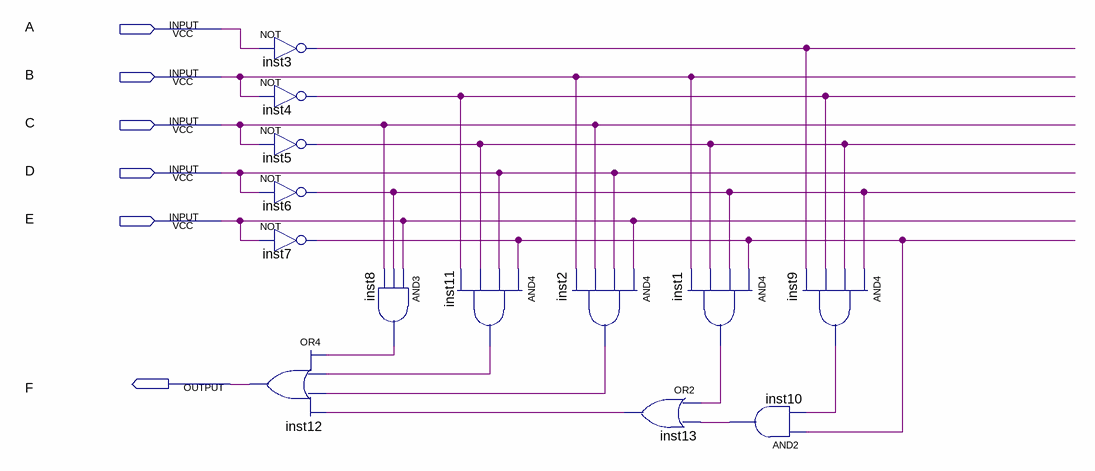
[diagram p0: schematic sheet]
// Quartus schematic lab2p1.bdf as structural Verilog: 13 symbols, 6 pins
module lab2p1 (
  input  A,
  input  B,
  input  C,
  input  D,
  input  E,
  output F
);

  wire inst1_out, inst2_out, inst3_out, inst4_out, inst5_out, inst6_out, inst7_out, inst8_out, inst9_out,
       inst10_out, inst11_out, inst13_out;

  not inst3 (inst3_out, A);
  not inst4 (inst4_out, B);
  not inst5 (inst5_out, C);
  not inst6 (inst6_out, D);
  not inst7 (inst7_out, E);
  or inst12 (F, inst8_out, inst11_out, inst2_out, inst13_out);
  and inst8 (inst8_out, E, inst6_out, C);
  and inst11 (inst11_out, inst7_out, D, inst5_out, inst4_out);
  and inst2 (inst2_out, E, D, C, B);
  or inst13 (inst13_out, inst1_out, inst10_out);
  and inst1 (inst1_out, inst7_out, inst6_out, inst5_out, B);
  and inst10 (inst10_out, inst7_out, inst9_out);
  and inst9 (inst9_out, inst6_out, inst5_out, inst4_out, inst3_out);
endmodule
